# EAGLE design Maka Niu Endcap (EAGLE 9.6.2)
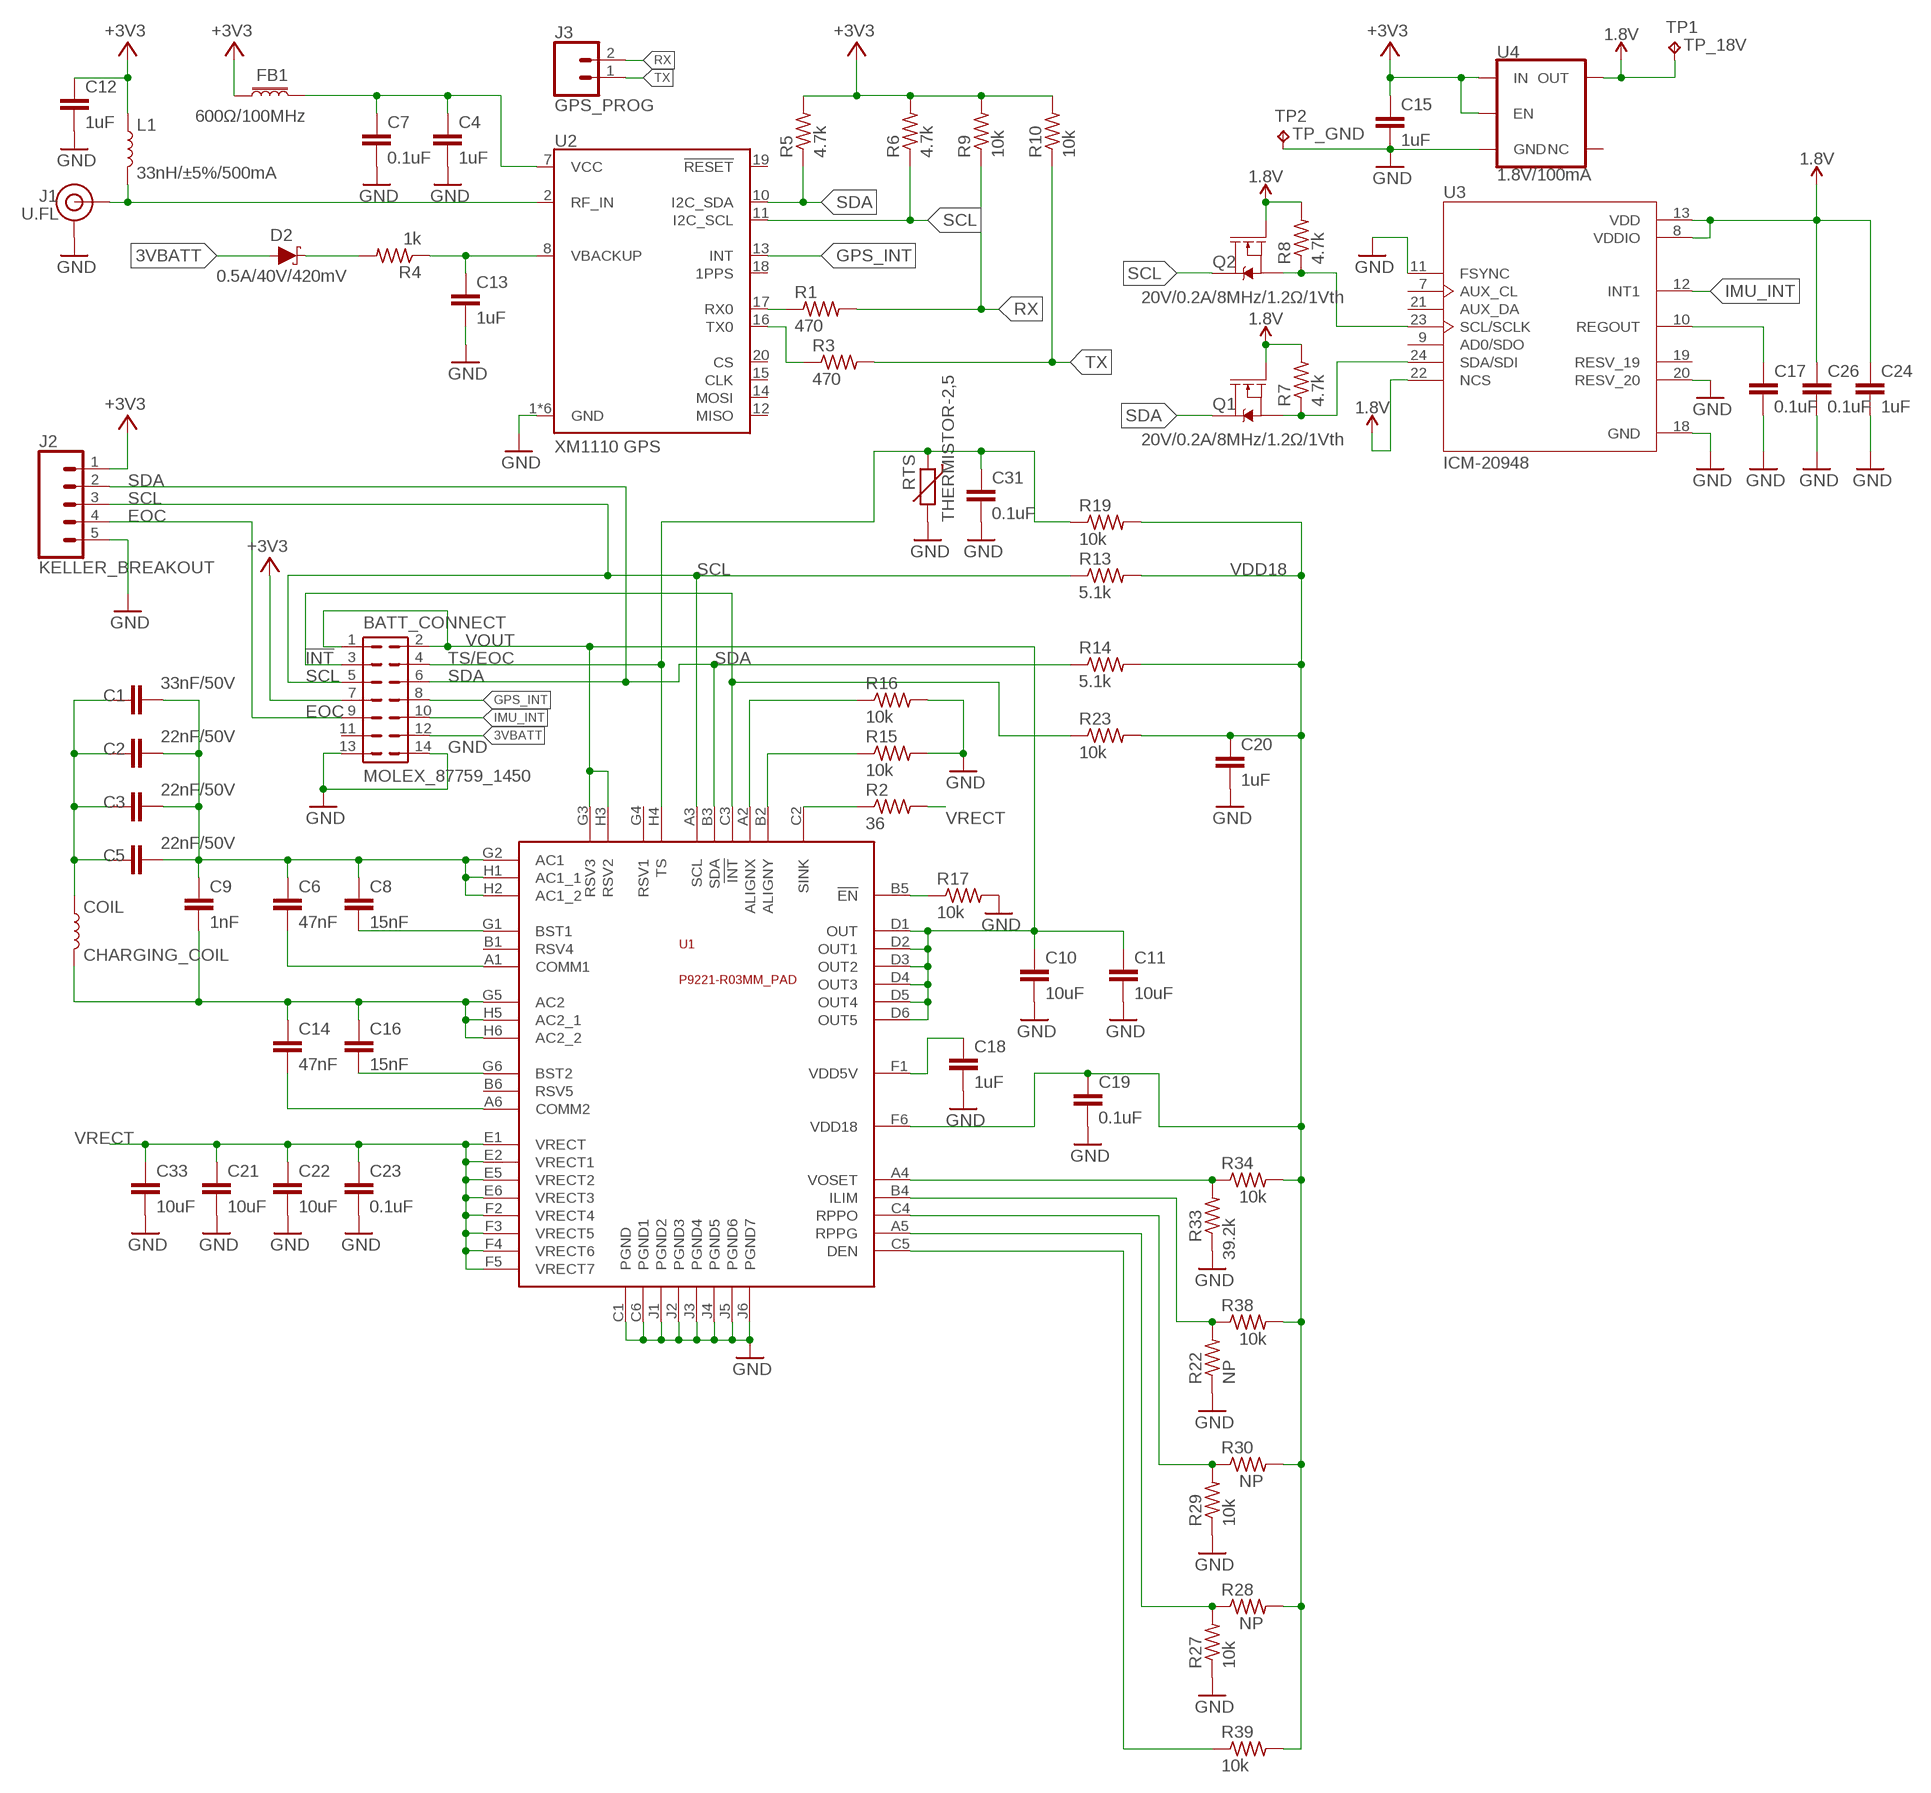
[diagram p0: schematic, sheet 1]

## Parts
BATT_CONNECT  MOLEX_87759_1450  [87759-1450]
C1  33nF/50V  C-EUC0402  [C0402]
C2  22nF/50V  C-EUC0402  [C0402]
C3  22nF/50V  C-EUC0402  [C0402]
C4  1uF  C-EUC0402  [C0402]
C5  22nF/50V  C-EUC0402  [C0402]
C6  47nF  C-EUC0402  [C0402]
C7  0.1uF  C-EUC0402  [C0402]
C8  15nF  C-EUC0402  [C0402]
C9  1nF  C-EUC0402  [C0402]
C10  10uF  C0603C0603W  [C_0603]
C11  10uF  C0603C0603W  [C_0603]
C12  1uF  C-EUC0402  [C0402]
C13  1uF  C-EUC0402  [C0402]
C14  47nF  C-EUC0402  [C0402]
C15  1uF  C-EUC0402  [C0402]
C16  15nF  C-EUC0402  [C0402]
C17  0.1uF  C-EUC0402  [C0402]
C18  1uF  C-EUC0402  [C0402]
C19  0.1uF  C-EUC0201  [C0201]
C20  1uF  C-EUC0402  [C0402]
C21  10uF  C0603C0603W  [C_0603]
C22  10uF  C0603C0603W  [C_0603]
C23  0.1uF  C-EUC0201  [C0201]
C24  1uF  C-EUC0402  [C0402]
C26  0.1uF  C-EUC0402  [C0402]
C31  0.1uF  C-EUC0201  [C0201]
C33  10uF  C0603C0603W  [C_0603]
COIL  CHARGING_COIL  [CHARGING_COIL]
D2  0.5A/40V/420mV  DIODE-SCHOTTKY-PMEG4005EJ  [SOD-323]
FB1  600Ω/100MHz  FERRITE_BEAD-0603  [0603]
J1  U.FL  U.FL2PIN  [U.FL]
J2  KELLER_BREAKOUT  WIRES_2MM_05  [WIRES_2MM_05]
J3  GPS_PROG  WIRES_2MM_02SMD  [WIRES_2MM_02SMD]
L1  33nH/±5%/500mA  INDUCTOR-0603-33NH  [0603]
Q1  20V/0.2A/8MHz/1.2Ω/1Vth  MOSFET-NCH-RE1C00UNTL  [SOT-416FL]
Q2  20V/0.2A/8MHz/1.2Ω/1Vth  MOSFET-NCH-RE1C00UNTL  [SOT-416FL]
R1  470  R-US_R0402  [R0402]
R2  36  R-US_R0805  [R0805]
R3  470  R-US_R0402  [R0402]
R4  1k  R-US_R0402  [R0402]
R5  4.7k  R-US_R0402  [R0402]
R6  4.7k  R-US_R0402  [R0402]
R7  4.7k  R-US_R0402  [R0402]
R8  4.7k  R-US_R0402  [R0402]
R9  10k  R-US_R0402  [R0402]
R10  10k  R-US_R0402  [R0402]
R13  5.1k  R-US_R0402  [R0402]
R14  5.1k  R-US_R0402  [R0402]
R15  10k  R0603R0603W  [R_0603]
R16  10k  R0603R0603W  [R_0603]
R17  10k  R-US_R0402  [R0402]
R19  10k  R-US_R0402  [R0402]
R22  NP  R-US_R0402  [R0402]
R23  10k  R-US_R0402  [R0402]
R27  10k  R-US_R0402  [R0402]
R28  NP  R-US_R0402  [R0402]
R29  10k  R-US_R0402  [R0402]
R30  NP  R-US_R0402  [R0402]
R33  39.2k  R-US_R0402  [R0402]
R34  10k  R-US_R0402  [R0402]
R38  10k  R-US_R0402  [R0402]
R39  10k  R-US_R0402  [R0402]
RTS  THERMISTOR-2,5  [RS-2,5]
TP1  TP_18V  TPB1,27  [B1,27]
TP2  TP_GND  TPB1,27  [B1,27]
U1  P9221-R03MM_PAD  [CSP52_2P64X3P94_0P4MM_03MMPAD]
U2  XM1110 GPS  XM1110_GPS  [XM1110_GPS]
U3  ICM-20948  [QFN40P300X300X105-24N]
U4  1.8V/100mA  V_REG_SP6214-1.8V  [SC70]

## Nets
1.8V: C24.1 C26.1 Q1.1(G) Q2.1(G) R7.2 R8.2 TP1.TP U3.8(VDDIO) U3.13(VDD) U3.22(NCS) U4.5(OUT)
3VBATT: BATT_CONNECT.12 D2.A
!INT: BATT_CONNECT.3 R23.1 U1.C3(!INT)
+3V3: BATT_CONNECT.7 C12.1 C15.1 FB1.1 J2.1 L1.1 R5.2 R6.2 R9.2 R10.2 U4.1(IN) U4.3(EN)
AC1: C1.2 C2.2 C3.2 C5.2 C6.1 C8.1 C9.1 U1.G2(AC1) U1.H1(AC1_1) U1.H2(AC1_2)
AC2: C9.2 C14.1 C16.1 COIL.B2 U1.G5(AC2) U1.H5(AC2_1) U1.H6(AC2_2)
ALIGNX: R16.1 U1.A2(ALIGNX)
ALIGNY: R15.1 U1.B2(ALIGNY)
BST1: C8.2 U1.G1(BST1)
BST2: C16.2 U1.G6(BST2)
COMM1: C6.2 U1.A1(COMM1)
COMM2: C14.2 U1.A6(COMM2)
DEN: R39.1 U1.C5(DEN)
EOC: BATT_CONNECT.9 J2.4
GND: BATT_CONNECT.13 BATT_CONNECT.14 C4.2 C7.2 C10.2 C11.2 C12.2 C13.2 C15.2 C17.2 C18.2 C19.2 C20.2 C21.2 C22.2 C23.2 C24.2 C26.2 C31.2 C33.2 J1.1(GND) J1.2(GND) J2.5 R15.2 R16.2 R17.2 R22.1 R27.1 R29.1 R33.1 RTS.2 TP2.TP U1.C1(PGND) U1.C6(PGND1) U1.J1(PGND2) U1.J2(PGND3) U1.J3(PGND4) U1.J4(PGND5) U1.J5(PGND6) U1.J6(PGND7) U2.1(GND) U2.3(GND) U2.4(GND) U2.5(GND) U2.6(GND) U2.9(GND) U3.11(FSYNC) U3.18(GND) U3.20(RESV_20) U4.2(GND)
GPS_INT: BATT_CONNECT.8 U2.13(INT)
ILIM: R22.2 R38.1 U1.B4(ILIM)
IMU_INT: BATT_CONNECT.10 U3.12(INT1)
LC: C1.1 C2.1 C3.1 C5.1 COIL.B1
N$6: R17.1 U1.B5(!EN)
N$24: D2.C R4.2
REGOUT: C17.1 U3.10(REGOUT)
RF_IN: J1.FEED(SIGNAL) L1.2 U2.2(RF_IN)
RPPG: R27.2 R28.1 U1.A5(RPPG)
RPPO: R29.2 R30.1 U1.C4(RPPO)
RX: J3.2 R1.2 R9.1
RX0: R1.1 U2.17(RX0)
SCL: BATT_CONNECT.5 J2.3 Q2.3(D) R6.1 R13.1 U1.A3(SCL) U2.11(I2C_SCL)
SCL/SCLK: Q2.2(S) R8.1 U3.23(SCL/SCLK)
SDA: BATT_CONNECT.6 J2.2 Q1.3(D) R5.1 R14.1 U1.B3(SDA) U2.10(I2C_SDA)
SDA/SDI: Q1.2(S) R7.1 U3.24(SDA/SDI)
SINK: R2.1 U1.C2(SINK)
TS/EOC: BATT_CONNECT.4 C31.1 R19.1 RTS.1 U1.H4(TS)
TX: J3.1 R3.2 R10.1
TX0: R3.1 U2.16(TX0)
VBACKUP: C13.1 R4.1 U2.8(VBACKUP)
VCC: C4.1 C7.1 FB1.2 U2.7(VCC)
VDD5V: C18.1 U1.F1(VDD5V)
VDD18: C19.1 C20.1 R13.2 R14.2 R19.2 R23.2 R28.2 R30.2 R34.2 R38.2 R39.2 U1.F6(VDD18)
VOSET: R33.2 R34.1 U1.A4(VOSET)
VOUT: BATT_CONNECT.1 BATT_CONNECT.2 C10.1 C11.1 U1.D1(OUT) U1.D2(OUT1) U1.D3(OUT2) U1.D4(OUT3) U1.D5(OUT4) U1.D6(OUT5) U1.G3(RSV3) U1.H3(RSV2)
VRECT: C21.1 C22.1 C23.1 C33.1 R2.2 U1.E1(VRECT) U1.E2(VRECT1) U1.E5(VRECT2) U1.E6(VRECT3) U1.F2(VRECT4) U1.F3(VRECT5) U1.F4(VRECT6) U1.F5(VRECT7)
Unconnected: BATT_CONNECT.11 U1.B1(RSV4) U1.B6(RSV5) U1.G4(RSV1) U2.12(MISO) U2.14(MOSI) U2.15(CLK) U2.18(1PPS) U2.19(!RESET) U2.20(CS) U3.7(AUX_CL) U3.9(AD0/SDO) U3.19(RESV_19) U3.21(AUX_DA) U4.4(NC)

## Library data of the parts
BATT_CONNECT = maka-niu:MOLEX_87759_1450; DIGI-KEY_PART_NUMBER: WM18654-ND; MF: MOLEX; MP: 0877591450
C1 = rcl:C-EU: CAPACITOR, European symbol; DIGI-KEY_PART_NUMBER: 490-13296-1-ND; MF: Murata Electronics; MP: GRM155R71H333KE02D; SPICEPREFIX: C
C2 C3 C5 = rcl:C-EU: CAPACITOR, European symbol; DIGI-KEY_PART_NUMBER: 490-6360-1-ND; MF: Murata Electronics; MP: GRM155R71H223KA12J; SPICEPREFIX: C
C4 C12 C13 C15 C18 C20 C24 = rcl:C-EU: CAPACITOR, European symbol; DIGI-KEY_PART_NUMBER: 311-1439-1-ND; MF: Yageo; MP: CC0402KRX5R6BB105; SPICEPREFIX: C
C6 C14 = rcl:C-EU: CAPACITOR, European symbol; DIGI-KEY_PART_NUMBER: 490-10702-1-ND; MF: Murata Electronics; MP: GRM155R71H473KE14D; SPICEPREFIX: C
C7 C17 C26 = rcl:C-EU: CAPACITOR, European symbol; DIGI-KEY_PART_NUMBER: 490-11917-1-ND; MF: Murata Electronics; MP: GRM155R61H104KE19D; SPICEPREFIX: C
C8 C16 = rcl:C-EU: CAPACITOR, European symbol; DIGI-KEY_PART_NUMBER: 490-16428-1-ND; MF: Murata Electronics; MP: GCM155R71H153JA55D; SPICEPREFIX: C
C9 = rcl:C-EU: CAPACITOR, European symbol; DIGI-KEY_PART_NUMBER: 732-7556-1-ND; MF: Würth Elektronik; MP: 885012205061; SPICEPREFIX: C
C10 C11 C21 C22 C33 = maka-niu:C0603; DIGI-KEY_PART_NUMBER: 445-9015-1-ND; MF: TDK Corporation; MP: C1608X5R1E106M080AC
C19 C31 = rcl:C-EU: CAPACITOR, European symbol; DIGI-KEY_PART_NUMBER: 445-7318-1-ND; MF: TDK Corporation; MP: C0603X5R1A104K030BC; SPICEPREFIX: C
C23 = rcl:C-EU: CAPACITOR, European symbol; DIGI-KEY_PART_NUMBER: 1276-1318-1-ND; MF: Samsung Electro-Mechanics; MP: CL03A104KA3NNNC; SPICEPREFIX: C
COIL = maka-niu:CHARGING_COIL
D2 = SparkFun-DiscreteSemi:DIODE-SCHOTTKY: Schottky diode A Schottky diode is a semiconductor diode which has a low forward voltage drop and a very fast switching action.; DIGI-KEY_PART_NUMBER: 1727-5209-1-ND; MF: Nexperia USA Inc.; MP: PMEG4005AEA,115; PROD_ID: DIO-10955
FB1 = SparkFun-Coils:FERRITE_BEAD: Ferrite Bead (blocks, cores, rings, chokes, etc.) Inductor with layers of ferrite used to suppress high frequencies. Often used to isolate high frequency noise. SparkFun Products: IOIO-OTG - V2.2 <https://www.sparkfun.com/products/13613> SparkFun SAMD21 Mini Breakout <https://www.sparkfun.com/products/13664> SparkFun 6 Degrees of Freedom Breakout - LSM6DS3 <https://www.sparkfun.com/products/13339> SparkFun SAMD21 Dev Breakout <https://www.sparkfun.com/products/13672>; DIGI-KEY_PART_NUMBER: 445-172898-1-ND; MF: TDK Corporation; MP: MPZ1608S601ATD25; PROD_ID: NDUC-07859; VALUE: 30Ω/1.8A
J1 = SparkFun-Connectors:U.FL2PIN: SMD Antenna Connector - U.FL 2mm height, 3.0mm x 3.0mm receptacle size. SparkFun Products: SparkFun WiFi Shield - ESP8266 <https://www.sparkfun.com/products/13287> SparkFun ESP8266 Thing <https://www.sparkfun.com/products/13231> SparkFun MiniGen - Pro Mini Signal Generator Shield <https://www.sparkfun.com/products/11420>; DIGI-KEY_PART_NUMBER: A144746CT-ND; MF: TE Connectivity AMP Connectors; MP: 2337019-1; PROD_ID: CONN-09193; SF_ID: WRL-09144
J2 = maka-niu:WIRES_2MM_05: 5 pin through hole 2mm pitch
J3 = maka-niu:WIRES_2MM_02SMD: 2 pin surface mount 2mm pitch
L1 = SparkFun-Coils:INDUCTOR: Inductors Resist changes in electrical current. Basically a coil of wire. SparkFun Products: SparkFun Load Cell Amplifier - HX711 <https://www.sparkfun.com/products/13879> IOIO-OTG - V2.2 <https://www.sparkfun.com/products/13613>; DIGI-KEY_PART_NUMBER: 490-14837-1-ND; MF: Murata Electronics; MP: LQG18HH33NJ00D; PROD_ID: NDUC-07874
Q1 Q2 = SparkFun-DiscreteSemi:MOSFET-NCH: N-channel MOSFETs Voltage controlled devices that allow control of high current outputs. SparkFun Products: SparkFun OpenScale <https://www.sparkfun.com/products/13261> SparkFun Digital Sandbox <https://www.sparkfun.com/products/12651> SparkFun Monster Moto Shield <https://www.sparkfun.com/products/10182> SparkFun MOSFET Power Controller <https://www.sparkfun.com/products/11214>; DIGI-KEY_PART_NUMBER: RE1C002UNTCLCT-ND; MF: Rohm Semiconductor; MP: RE1C002UNTCL; PROD_ID: TRANS-14399
R1 R3 = rcl:R-US_: RESISTOR, American symbol; DIGI-KEY_PART_NUMBER: RMCF0402JT470RCT-ND; MF: Stackpole Electronics Inc.; MP: RMCF0402JT470R; SPICEPREFIX: R
R2 = rcl:R-US_: RESISTOR, American symbol; DIGI-KEY_PART_NUMBER: P36ADCT-ND; MF: Panasonic Electronic Components; MP: ERJ-P06J360V; SPICEPREFIX: R
R4 = rcl:R-US_: RESISTOR, American symbol; DIGI-KEY_PART_NUMBER: RMCF0402JT1K00CT-ND; MF: Stackpole Electronics Inc.; MP: RMCF0402JT1K00; SPICEPREFIX: R
R5-R8 = rcl:R-US_: RESISTOR, American symbol; DIGI-KEY_PART_NUMBER: RMCF0402JT4K70CT-ND; MF: Stackpole Electronics Inc.; MP: RMCF0402JT4K70; SPICEPREFIX: R
R9 R10 = rcl:R-US_: RESISTOR, American symbol; DIGI-KEY_PART_NUMBER: RMCF0402JT10K0CT-ND; MF: Stackpole Electronics Inc.; MP: RMCF0402JT10K0; SPICEPREFIX: R
R13 R14 = rcl:R-US_: RESISTOR, American symbol; DIGI-KEY_PART_NUMBER: CR0402-JW-512GLFCT-ND; MF: Bourns Inc.; MP: CR0402-JW-512GLF; SPICEPREFIX: R
R15 R16 = maka-niu:R0603; DIGI-KEY_PART_NUMBER: 311-10.0KHRCT-ND; MF: Yageo; MP: RC0603FR-0710KL
R17 R19 R23 R27 R29 R34 R38 R39 = rcl:R-US_: RESISTOR, American symbol; DIGI-KEY_PART_NUMBER: 541-10KATCT-ND; MF: Vishay Dale; MP: CRCW040210K0JNEDIF; SPICEPREFIX: R
R22 R28 R30 = rcl:R-US_: RESISTOR, American symbol; SPICEPREFIX: R
R33 = rcl:R-US_: RESISTOR, American symbol; DIGI-KEY_PART_NUMBER: 311-39.2KLBCT-ND; MF: Yageo; MP: AC0402FR-0739K2L; SPICEPREFIX: R
RTS = maka-niu:THERMISTOR: THERMISTOR
TP1 = testpad:TP: Test pad; TP_SIGNAL_NAME: TP_18V
TP2 = testpad:TP: Test pad; TP_SIGNAL_NAME: TP_GND
U1 = maka-niu:P9221-R: Renesas/IDT P9221-R 15W Qi Wireless Charging Receiver; DIGI-KEY_PART_NUMBER: 800-3932-2-ND; MF: Renesas Electronics America Inc.; MP: P9221-RAHGI8
U2 = maka-niu:XM1110_GPS: AirPrime XM1110 GPS; DIGI-KEY_PART_NUMBER: 1645-XM1110_1104311CT-ND; MF: Sierra Wireless; MP: XM1110_1104311
U3 = ICM-20948:ICM-20948: Axis=3 Axis Gyro+3 Axis Accel+Compass. Pin For Pin With m; DESCRIPTION: Accelerometer, Gyroscope, Magnetometer, 9 Axis Sensor I²C, SPI Output; DIGI-KEY_PART_NUMBER: 1428-1123-1-ND; MF: TDK InvenSense; MP: ICM-20948; PACKAGE: QFN-24 InvenSense
U4 = SparkFun-IC-Power:V_REG_SP6214: Voltage Regulator - SP6214 SP6214 Series SC-70-5 Micropower SC-70 100 mA CMOS LDO Regulator Datasheet <https://www.exar.com/content/document.ashx?id=654> SparkFun Products: MP3 Trigger <https://www.sparkfun.com/products/13720> SparkFun Particle Sensor Breakout <https://www.sparkfun.com/products/14045>; DIGI-KEY_PART_NUMBER: 576-2807-1-ND; MF: Microchip Technology; MP: MIC5253-1.8YC5-TR; PROD_ID: VREG-08428

## Board
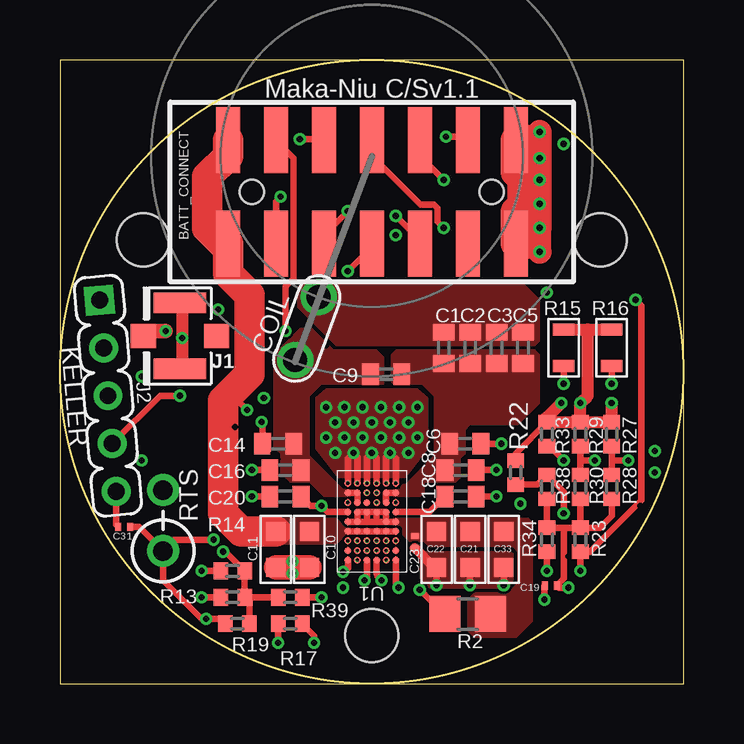
[diagram p1: board, top side]
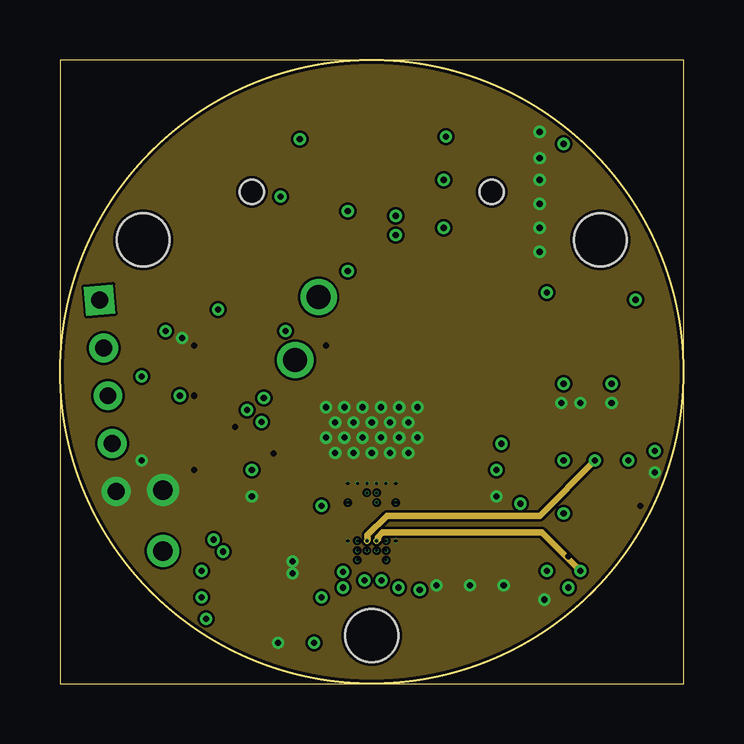
[diagram p2: board, inner layer Route2]
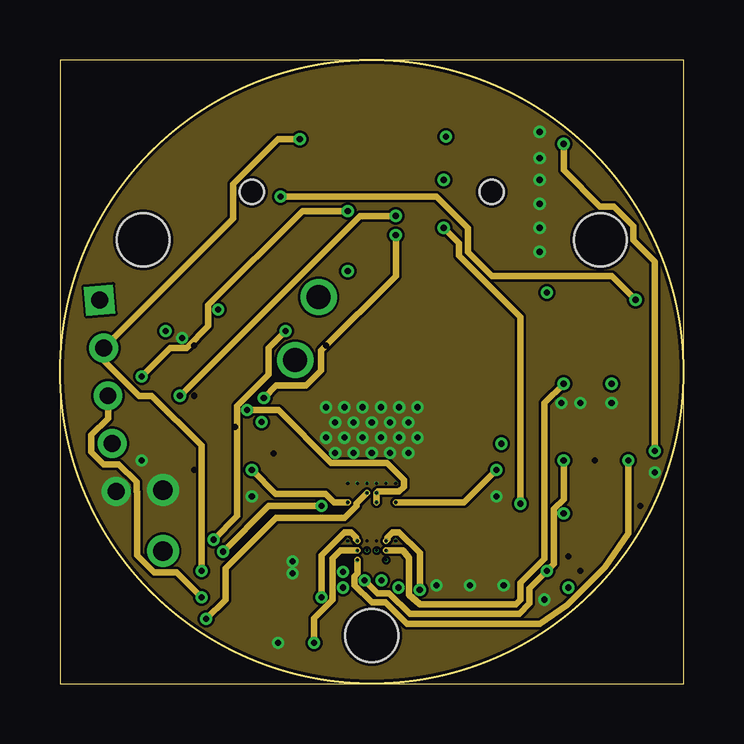
[diagram p3: board, inner layer Route3]
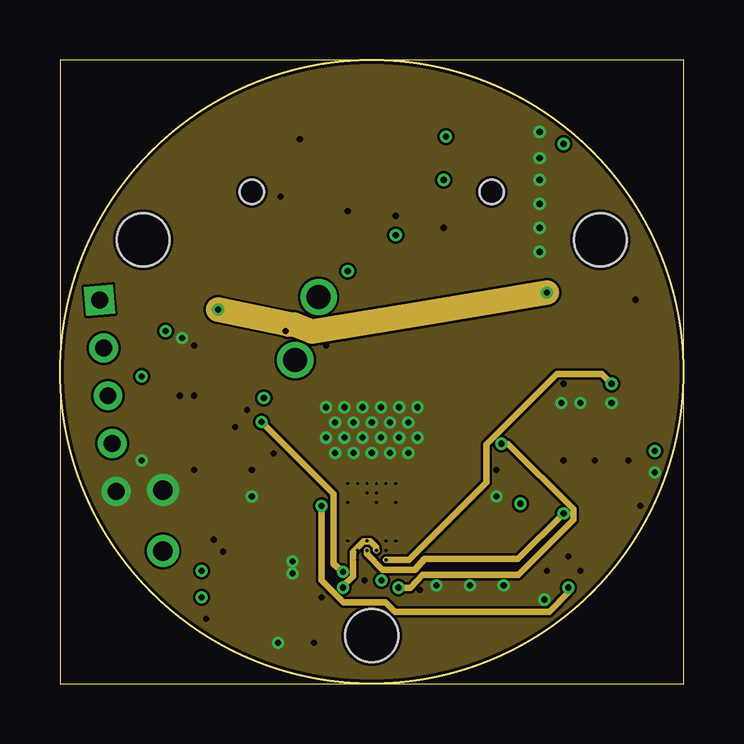
[diagram p4: board, inner layer Route14]
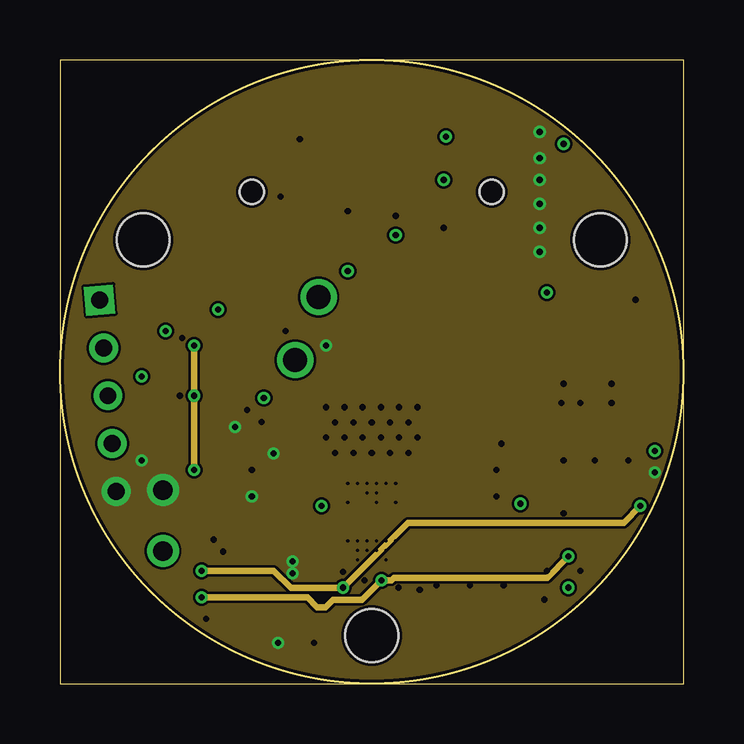
[diagram p5: board, inner layer Route15]
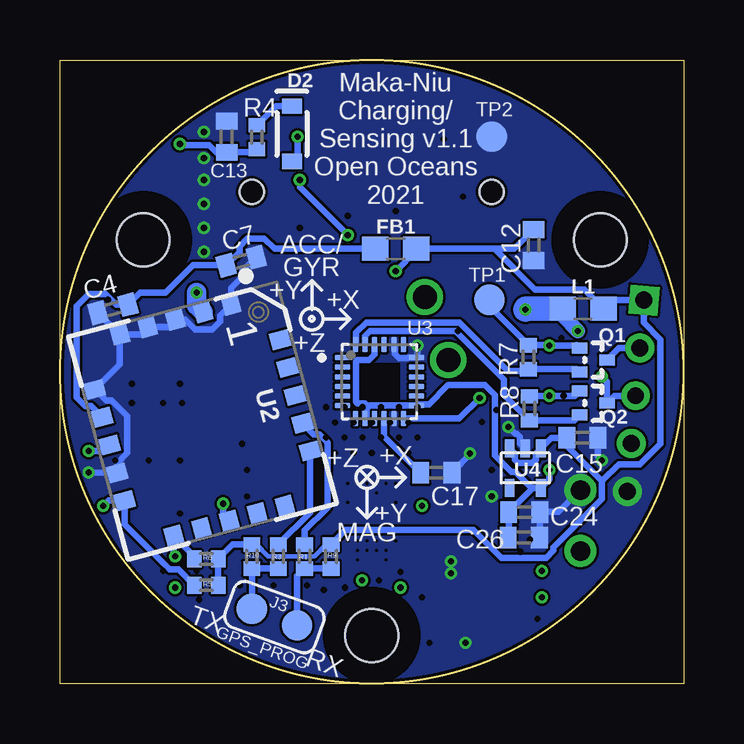
[diagram p6: board, bottom side, seen from below]

Size 26 x 26 mm. Coordinates in mm from the lower left corner, seen from the top.
Outline: 0,0 26,0 26,26 0,26 0,0
Outline: circle at 13,13 radius 13
Copper layers ([3:[2:[14:1+2+3*14+(15*16)]]]): Top 0.035mm / dielectric 0.075mm / Route2 0.035mm / dielectric 0.075mm / Route3 0.035mm / dielectric 0.075mm / Route14 0.035mm / dielectric 0.18mm / Route15 0.035mm / dielectric 0.9mm / Bottom 0.035mm
Design rules "default *": minimum track width 6mil, minimum drill 5mil, track to track 4mil, track to pad 4mil, pad to pad 4mil, via to via 4mil, smd to smd 4mil, copper to edge 6mil, drill to drill 6mil, minimum pad ring 10mil, minimum via ring 0mil, stop-mask expansion 4mil, vias tented up to drill 0mil, thermal gap 10mil
Holes 2.2 mm at 13,2 22.53,18.5 3.47,18.5
tRestrict: area 11,0 to 15,4; area 20.5,16.5 to 24.5,20.5; area 1.5,16.5 to 5.5,20.5
bRestrict: area 11,0 to 15,4; area 1.5,16.5 to 5.5,20.5; area 20.5,16.5 to 24.5,20.5

### Footprints (pad centres in the part's own frame; a part is rotated, then mirrored left to right if it is on the bottom)
87759-1450 = smd 1 x 2.75: 1 -6,-2.15; 2 -6,2.15; 3 -4,-2.15; 4 -4,2.15; 5 -2,-2.15; 6 -2,2.15; 7 0,-2.15; 8 0,2.15; 9 2,-2.15; 10 2,2.15; 11 4,-2.15; 12 4,2.15; 13 6,-2.15; 14 6,2.15 | hole 1: -5,0; 5,0
C0402 = smd 0.7 x 0.9: 1 -0.65,0; 2 0.65,0
C_0603 = smd 0.8 x 0.8: 1 -0.75,0; 2 0.75,0
C0201 = smd 0.25 x 0.35: 1 -0.25,0; 2 0.25,0
CHARGING_COIL = drill 1: B1 -1.4,0; B2 1.4,0
SOD-323 = smd 0.63 x 0.83: A 1.15,0; C -1.15,0
0603 = smd 1.1 x 1: 1 -0.85,0; 2 0.85,0
U.FL = smd 2.2 x 0.85: 1 0,1.375; 2 0,-1.375 | smd 1.05 x 1: FEED 1.525,0; NC -1.525,0
WIRES_2MM_05 = drill 0.7 square: 1 -4,0 | drill 0.7: 2 -2,0; 3 0,0; 4 2,0; 5 4,0
WIRES_2MM_02SMD = smd 1.27 x 1.27: 1 -1,0; 2 1,0
SOT-416FL = smd 0.46 x 0.65: 1 -0.5,-1.1; 2 0.5,-1.1; 3 0,0.05
R0402 = smd 0.6 x 0.7: 1 -0.5,0; 2 0.5,0
R0805 = smd 1.3 x 1.5: 1 -0.95,0; 2 0.95,0
R_0603 = smd 0.5 x 0.9: 1 -0.762,0; 2 0.762,0
RS-2,5 = drill 0.813: 1 -1.27,0; 2 1.27,0
B1,27 = smd 1.27 x 1.27: TP 0,0
CSP52_2P64X3P94_0P4MM_03MMPAD = smd 0.3 x 0.3: A1 -1,1.6; A2 -0.6,1.6; A3 -0.2,1.6; A4 0.2,1.6; A5 0.6,1.6; A6 1,1.6; B1 -1,1.2; B2 -0.6,1.2; B3 -0.2,1.2; B4 0.2,1.2; B5 0.6,1.2; B6 1,1.2; C1 -1,0.8; C2 -0.6,0.8; C3 -0.2,0.8; C4 0.2,0.8; C5 0.6,0.8; C6 1,0.8; D1 -1,0.4; D2 -0.6,0.4; D3 -0.2,0.4; D4 0.2,0.4; D5 0.6,0.4; D6 1,0.4; E1 -1,0; E2 -0.6,0; E5 0.6,0; E6 1,0; F1 -1,-0.4; F2 -0.6,-0.4; F3 -0.2,-0.4; F4 0.2,-0.4; F5 0.6,-0.4; F6 1,-0.4; G1 -1,-0.8; G2 -0.6,-0.8; G3 -0.2,-0.8; G4 0.2,-0.8; G5 0.6,-0.8; G6 1,-0.8; H1 -1,-1.2; H2 -0.6,-1.2; H3 -0.2,-1.2; H4 0.2,-1.2; H5 0.6,-1.2; H6 1,-1.2; J1 -1,-1.6; J2 -0.6,-1.6; J3 -0.2,-1.6; J4 0.2,-1.6; J5 0.6,-1.6; J6 1,-1.6
XM1110_GPS = smd 0.8 x 0.7: 1 -4.35,2.4; 2 -4.35,1.2; 3 -4.35,0; 4 -4.35,-1.2; 5 -4.35,-2.4; 11 4.35,-2.4; 12 4.35,-1.2; 13 4.35,0; 14 4.35,1.2; 15 4.35,2.4 | smd 0.7 x 0.8: 6 -2.4,-4; 7 -1.2,-4; 8 0,-4; 9 1.2,-4; 10 2.4,-4; 16 2.4,4; 17 1.2,4; 18 0,4; 19 -1.2,4; 20 -2.4,4
QFN40P300X300X105-24N = smd 0.64 x 0.22: 1 -1.545,1; 2 -1.545,0.6; 3 -1.545,0.2; 4 -1.545,-0.2; 5 -1.545,-0.6; 6 -1.545,-1; 13 1.545,-1; 14 1.545,-0.6; 15 1.545,-0.2; 16 1.545,0.2; 17 1.545,0.6; 18 1.545,1 | smd 0.22 x 0.64: 7 -1,-1.545; 8 -0.6,-1.545; 9 -0.2,-1.545; 10 0.2,-1.545; 11 0.6,-1.545; 12 1,-1.545; 19 1,1.545; 20 0.6,1.545; 21 0.2,1.545; 22 -0.2,1.545; 23 -0.6,1.545; 24 -1,1.545
SC70 = smd 0.4 x 0.75: 1 -0.65,-0.825; 2 0,-0.825; 3 0.65,-0.825; 4 0.65,0.825; 5 -0.65,0.825

### Placement (x,y rotation side)
BATT_CONNECT  13,20.5 0 top
C1  16,14 270 top
C2  17.1,14 270 top
C3  18.2,14 270 top
C4  23.79,15.63 195 bottom
C5  19.3,14 270 top
C6  16.9,10 0 top
C7  18.44,17.61 15 bottom
C8  16.7,8.9 0 top
C9  13.6,12.9 180 top
C10  10.4,5.6 270 top
C11  9,5.6 270 top
C12  6.25,18.28 270 bottom
C13  19.05,22.8 90 bottom
C14  9.1,10 180 top
C15  4.22,10.25 0 bottom
C16  9.4,8.9 180 top
C17  10.31,8.79 0 bottom
C18  16.7,7.8 0 top
C19  20.46,4.09 180 top
C20  9.4,7.8 180 top
C21  17.1,5.6 270 top
C22  15.7,5.6 270 top
C23  14.8,5.9 270 top
C24  6.64,7.15 0 bottom
C26  6.66,6.09 0 bottom
C31  2.68,6.53 180 top
C33  18.5,5.6 270 top
COIL  10.3,14.8 249.6 top
D2  16.33,22.92 270 bottom
FB1  12,18.13 180 bottom
J1  5,14.5 180 top
J2  2,12 275 top
J3  17.06,2.77 340 bottom
L1  4.19,15.63 180 bottom
Q1  3.24,13.49 270 bottom
Q2  3.24,11.69 270 bottom
R1  15.8,5.3 270 bottom
R2  17,2.9 0 top
R3  16.9,5.3 270 bottom
R4  17.79,22.78 90 bottom
R5  19.9,4.1 0 bottom
R6  19.9,5.2 0 bottom
R7  6.47,13.61 90 bottom
R8  6.43,11.47 90 bottom
R9  14.7,5.3 90 bottom
R10  18,5.3 90 bottom
R13  7.2,3.6 0 top
R14  7.2,4.7 0 top
R15  21,14 90 top
R16  23,14 90 top
R17  9.6,2.5 180 top
R19  7.4,2.5 0 top
R22  19,8.8 270 top
R23  21.7,6 90 top
R27  23,10.4 270 top
R28  23,8.2 270 top
R29  21.7,10.4 270 top
R30  21.7,8.2 270 top
R33  20.3,10.4 270 top
R34  20.3,6 90 top
R38  20.3,8.2 270 top
R39  9.6,3.6 180 top
RTS  4.3,6.8 90 top
TP1  8.1,16 0 bottom
TP2  8,22.8 0 bottom
U1  13,6.75 180 top
U2  20.06,10.98 285 bottom
U3  12.68,12.59 0 bottom
U4  6.6,8.98 180 bottom

### Tracks (layer width: path | path; a pad name or v marks a point on that pad's centre or on a via)
1.8V  (via drill 0.25 pad 0.51 layers 15-16)
  Route15 0.268: v5.6,14.1 v5.6,12 v5.6,8.9
  Bottom 0.268: Q1.1 4.46,14.11 4.47,14.1 v5.6,14.1 v5.61,14.11 R7.2 8.1,15.74 TP1.TP | C26.1 7.29,6.11 C24.1 6.29,8.15 U4.5 | U4.5 6.34,8.15 7.01,8.82 7.18,8.82 7.86,9.51 7.86,12.02 8.28,12.44 9.79,12.44 9.85,12.42 10.62,11.64 11.08,11.64 U3.13 11.48,11.59 11.49,11.6 13.07,11.6 13.23,11.45 13.23,11.1 U3.8 13.28,11.69 13.59,11.69 13.66,11.76 13.66,13.42 13.59,13.49 13.11,13.49 12.88,13.72 U3.22 | U4.5 5.6,8.51 v5.6,8.9 | R8.2 6.4,12 v5.6,12 4.53,12 Q2.1
3VBATT  (via drill 0.25 pad 0.51)
  Top 0.268: v16.1,22.8 16.85,22.8 BATT_CONNECT.12
  Bottom 0.268: D2.A 16.1,22 v16.1,22.8
!INT  (via drill 0.13 pad 0.15 layers 1-2, 0.25 pad 0.51 layers 1-2, 0.25 pad 0.51 layers 1-3)
  Top 0.268: v21.7,4.7 R23.1 22.1,5.5 24.24,7.64 24.24,15.76 v24,16 | BATT_CONNECT.3 9,20.1 v9.2,20.3
  Route2 0.268: U1.C3 13.25,6 13.25,6.09 13.46,6.3 20.1,6.3 v21.7,4.7
  Route3 0.268: v24,16 23,17 18,17 17,18 17,19 15.7,20.3 v9.2,20.3
  other vias: 13.2,5.95
+3V3  (via drill 0.25 pad 0.51)
  Top 0.268: v12,17.2 13,18.2 BATT_CONNECT.7
  Bottom 0.152: R10.2 17.8,5.8 | 14.9,5.8 R9.2
  Bottom 0.18: 17.8,5.8 17.32,5.3 | 15.38,5.3 14.9,5.8
  Bottom 0.19: 17.32,5.3 15.38,5.3
  Bottom 0.268: R5.2 R6.2 18.8,5.8 R10.2 | 6.23,18.95 C12.1 7.05,18.13 7.88,18.13 | 7.88,18.13 FB1.1 11.15,18.05 v12,17.2 | 7.88,18.13 6.19,16.43 4.14,16.43 L1.1 2.98,15.98 J2.1 1.65,15.04 0.96,14.35 0.96,10 1.81,9.14 2.7,9.14 3.4,8.44 | U4.3 7.04,9.59 7.04,9.33 6.9,9.19 6.3,9.19 6.16,9.33 6.16,9.59 U4.1 5.5,10.25 C15.1 4.87,9.91 3.4,8.44 | R9.2 14.1,6.4 8.75,6.4 7.59,5.24 5.73,5.24 5.42,5.54 5.42,5.68 3.4,7.7 3.4,8.44
AC1
  Top 0.268: U1.G2 U1.H2 U1.H1
  pour Top (no thermals): 13.9,12.5 15.1,12.5 15.6,12 15.6,9.5 14.4,8.3 14.3,8.3 14.2,8.2 14.2,8.1 13.9,8.1 13.9,7.8 15,7.8 15.2,8 15.2,8.4 16.5,8.4 16.7,8.6 16.7,9.4 16.9,9.6 16.9,10.6 17.1,10.8 19.1,10.8 20,11.7 20,13.7 19.8,13.9 14,13.9 13.8,13.7 13.8,12.6
AC2
  Top 0.268: U1.H6 U1.H5 U1.G5
  pour Top (no thermals): 10.9,12.5 13.5,12.5 13.5,13.6 13.2,13.9 11.4,13.9 10.5,14.8 10,14.8 8.9,13.7 8.9,9.9 9.2,9.6 9.2,8.8 9.6,8.4 10.4,8.4 11,7.8 12.1,7.8 12.1,8.1 11.8,8.1 10.4,9.5 10.4,12
ALIGNX  (via drill 0.13 pad 0.15 layers 1-14, 0.25 pad 0.51 layers 1-14)
  Top 0.268: v23,12.5 R16.1
  Route14 0.268: U1.A2 14.55,5.15 17.79,8.39 17.79,9.97 20.73,12.91 20.83,12.91 21,12.91 22.59,12.91 v23,12.5
  other vias: 13.6,5.15
ALIGNY  (via drill 0.13 pad 0.15 layers 1-3, 0.25 pad 0.51 layers 1-3)
  Top 0.268: v21,12.5 R15.1
  Route3 0.268: U1.B2 14.3,5.55 14.55,5.25 14.55,3.7 15,3.3 19,3.3 19.2,3.5 19.2,4.2 20.2,5.2 20.2,11.7 v21,12.5
  other vias: 13.6,5.55
BST1  (via drill 0.13 pad 0.15 layers 1-3, 0.25 pad 0.51 layers 1-3)
  Top 0.268: v18.2,8.9 C8.2
  Route3 0.268: U1.G1 16.85,7.55 v18.2,8.9
  other vias: 14,7.55
BST2  (via drill 0.13 pad 0.15 layers 1-3, 0.25 pad 0.51 layers 1-3)
  Top 0.268: v8,8.9 C16.2
  Route3 0.268: U1.G6 11.44,7.55 11.07,7.91 8.99,7.91 v8,8.9
  other vias: 12,7.55
COMM1  (via drill 0.25 pad 0.51 layers 1-14)
  Top 0.268: v18.4,10 C6.2 | U1.A1 14,4.1 v14.11,4
  Route14 0.268: v14.11,4 14.61,4 15.12,4.53 19.11,4.53 21.41,6.83 21.41,7.27 18.68,10 v18.4,10
COMM2  (via drill 0.25 pad 0.51 layers 1-14)
  Top 0.268: v8.4,10.9 8.45,10.85 C14.2 | U1.A6 12,4.8 v11.8,4.65
  Route14 0.268: v11.8,4.65 11.4,5 11.4,7.9 v8.4,10.9
DEN  (via drill 0.13 pad 0.15 layers 1-3, 0.25 pad 0.51 layers 1-3)
  Top 0.268: v10.9,3.6 R39.1
  Route3 0.268: U1.C5 12.35,6 12.35,6.09 12.14,6.3 11.86,6.3 10.9,5.34 v10.9,3.6
  other vias: 12.4,5.95
EOC  (via drill 0.25 pad 0.51 layers 1-3)
  Top 0.268: J2.4 4.17,12 v5,12 | BATT_CONNECT.9 15,18.5 v14,19.5
  Route3 0.268: v5,12 12.5,19.5 v14,19.5
GND  (via drill 0.13 pad 0.15 layers 1-14, 0.25 pad 0.51, 0.25 pad 0.51 layers 1-14, 0.25 pad 0.51 layers 15-16)
  Top 0.268: U1.J4 12.8,9.42 v13,9.62 13.2,9.42 U1.J3 | U1.J5 12.4,9.46 v12.24,9.62 12,9.38 U1.J6 | U1.J2 13.6,9.46 v13.76,9.62 14,9.38 U1.J1 | v18.2,7.8 C18.2 | C11.2 9.45,4.85 v9.7,4.6 v9.7,5.1 9.95,4.85 C10.2 | R17.2 v9.1,1.7 | v8,7.8 C20.2 | v20.2,3.5 C19.2 | C31.2 2.35,6.61 J2.5 | v15.7,4.1 C22.2 | v17.1,4.1 C21.2 | v18.5,4.1 C33.2 | R22.1 19,9.6 R33.1
  Top 0.406: C23.2 15.6,4.85 C22.2
  Top 0.508: v20.9,11.7 20.3,11.1 R33.1 R29.1 | R29.1 v21.7,11.7 22,12 22,14.76 | v23,11.7 R27.1 R29.1 | R15.2 22,14.76 | 22,14.76 R16.2 | J1.2 5.1,15.78 v5.1,14.4 5.1,13.22 J1.1
  Top 0.95: v20,18 v20,19
  Top 1: v20,19 v20,20 v20,21 v20,21.9 20,22.89 | v20,23 19.65,22.65 | v20,18 19.65,18.35
  Top 1.016: C11.2 C10.2
  Top 1.27: 19.65,22.65 BATT_CONNECT.14 19,21.32 19.29,21.03 19.29,19.97 19,19.68 BATT_CONNECT.13 19.65,18.35
  Bottom 0.268: U3.20 12.03,14.08 12.03,13.73 11.87,13.58 11.49,13.58 11.48,13.59 U3.18 11.1,13.62 v11.1,14.1 | C26.2 5.99,6.11 C24.2 5.22,7.15 RTS.2 | C15.2 3.57,9.47 v3.4,9.3 | U4.2 6.81,10.02 6.81,10.28 6.95,10.42 7.02,10.42 v7.3,10.7 | C17.2 8.9,9.55 v8.9,9.6 | C4.2 23.52,14.56 U2.5 | U2.5 22.66,14.56 U2.4 21.5,14.87 U2.3 20.79,15.18 20.37,14.76 19.66,14.76 19.33,15.09 19.33,15.34 U2.1 18.87,16.49 18.36,16.99 18.36,17.23 C7.2 | U2.5 23.5,13.3 U2.6 24.08,11.8 23.83,11.8 23.19,11.16 23.19,9.61 23.61,9.19 U2.9 v24.8,8.8
  other vias: 11.09,11.52 11.86,11.52 12.62,11.52 13.38,11.52 14.14,11.52 14.9,11.52 12.62,10.25 13.38,10.25 11.48,10.89 14.52,10.89 11.09,10.25 14.9,10.25 13,10.89 12.24,10.89 13.76,10.89 11.86,10.25 14.14,10.25 11.48,9.62 14.52,9.62 12,8.35 12.4,8.35 12.8,8.35 13.2,8.35 13.6,8.35 14,8.35 12,5.95 14,5.95
  pour Top (no thermals): 11.6,8.6 14.4,8.6 15.35,9.79 15.35,11.9 14.9,12.28 11.09,12.28 10.65,11.9 10.65,9.79
  pour Top (no thermals): 15,4.4 15.4,4 18.6,4 18.9,4.3 18.9,5.4 18.8,5.5 15.2,5.5 15,5.3
  pour Route2 (no thermals): 13,26 arc-90 26,13 arc-90 13,0 arc-90 0,13 arc-90
  pour Bottom (no thermals): 13,26 arc90 0,13 arc90 13,0 arc90 26,13 arc90
  pour Route15 (no thermals): 13,26 arc-90 26,13 arc-90 13,0 arc-90 0,13 arc-90
  pour Route14 (no thermals): 13,26 arc90 0,13 arc90 13,0 arc90 26,13 arc90
  pour Route3 (no thermals): 13,26 arc-90 26,13 arc-90 13,0 arc-90 0,13 arc-90
GPS_INT  (via drill 0.25 pad 0.51, 0.25 pad 0.51 layers 1-3)
  Top 0.268: BATT_CONNECT.8 13,22 15.04,19.96 15.6,19.96 15.74,19.82 15.74,19.26 v16,19
  Route3 0.268: v16,19 16.63,18.37 16.63,17.85 19.2,15.28 v19.2,7.5
  Bottom 0.268: v19.2,7.5 19.2,7.04 U2.13
ILIM  (via drill 0.13 pad 0.15 layers 1-14, 0.25 pad 0.51 layers 1-14)
  Top 0.268: v21,7.1 21,8 R38.1 19.9,8.3 R22.2
  Route14 0.268: v21,7.1 19.1,5.2 15.2,5.2 14.8,4.75 13.46,4.75 12.8,5.41 U1.B4
  other vias: 12.8,5.55
IMU_INT  (via drill 0.25 pad 0.51)
  Top 0.268: v16,21 15,22 BATT_CONNECT.10
  Route3 0.268: v8.5,11.9 9.02,12.42 10.26,12.42 10.88,13.04 10.88,13.88 14,17 v14,18.7
  Bottom 0.268: v8.5,11.9 9.36,11.04 U3.12 | v14,18.7 16,20.7 v16,21
LC
  pour Top (no thermals): 20,16 19.2,16.8 10.2,16.8 9.9,16.5 9.9,15.7 11.5,14.1 19.8,14.1 20,14.3
N$6  (via drill 0.13 pad 0.15 layers 1-3, 0.25 pad 0.51 layers 1-3)
  Top 0.268: v10.6,1.7 10.6,2 R17.1
  Route3 0.268: U1.B5 11.7,5.55 11.37,5.22 11.37,3.48 10.6,2.71 v10.6,1.7
  other vias: 12.4,5.55
N$24
  Bottom 0.268: R4.2 17,24.07 D2.C
REGOUT
  Bottom 0.268: C17.1 12.48,10.31 U3.10
RF_IN  (via drill 0.25 pad 0.51)
  Top 0.268: J1.FEED 3.67,14.7
  Top 0.61: 3.67,14.7 v4.4,14.7
  Route14 1.016: v20.3,16.3 15.09,15.44 11.04,14.76 10.53,14.68 10.52,14.68 9.76,14.96 9.54,14.96 9.5,15 v6.6,15.6
  Bottom 0.268: 5.04,15.34 L1.2
  Bottom 0.61: v4.4,14.7 5.04,15.34
  Bottom 0.813: v20.3,16.3 20.3,15.77 U2.2
  Bottom 1.016: L1.2 6.57,15.63 v6.6,15.6
RPPG  (via drill 0.13 pad 0.15 layers 1-3, 0.25 pad 0.51 layers 1-3)
  Top 0.268: R27.2 23,9.3 | 23,9.3 R28.1 | v23.7,9.3 23,9.3
  Route3 0.268: v23.7,9.3 23.7,6.27 22.71,4.85 21.15,3.29 20.02,2.5 14.46,2.5 13.57,3.39 13,3.39 12.29,4.1 12.29,4.47 12.4,4.58 U1.A5
  other vias: 12.4,5.15
RPPO  (via drill 0.13 pad 0.15 layers 1-2, 0.25 pad 0.51 layers 1-2)
  Top 0.268: R29.2 21.7,9.3 | 21.7,9.3 R30.1 | v22.3,9.3 21.7,9.3
  Route2 0.268: U1.C4 12.83,5.98 12.83,6.2 13.63,7 20,7 v22.3,9.3
  other vias: 12.8,5.95
RX
  Bottom 0.268: J3.2 16.12,4.48 R1.2 R9.1
RX0
  Bottom 0.268: R1.1 15.8,6.38 14.85,7.33 14.85,10.06 15.18,10.39 15.42,10.39 U2.17
SCL  (via drill 0.25 pad 0.51, 0.25 pad 0.51 layers 1-3, 0.25 pad 0.51 layers 15-16)
  Top 0.268: v5.9,3.6 R13.1 | U1.A3 13.2,4.56 13.24,4.52 13.24,4.46 v13.4,4.3 | v12,19.7 11,18.7 BATT_CONNECT.5
  Route3 0.268: v5.9,3.6 4.87,4.63 3.93,4.63 3.21,5.35 3.21,7.99 3.19,8.02 3.19,8.4 2.45,9.14 1.81,9.14 1.31,9.65 1.31,10.37 2,11.06 J2.3 | v12,19.7 10.12,19.7 6.19,15.77 6.19,14.9 5.27,13.99 4.59,13.99 v3.4,12.8
  Route15 0.268: v5.9,3.6 10.31,3.6 10.73,3.19 11.07,3.19 11.38,3.5 12.6,3.5 v13.4,4.3 13.81,4.3 13.93,4.41 20.31,4.41 v21.2,5.3
  Bottom 0.268: R6.1 20.4,5.3 U2.11 21.25,5.35 v21.2,5.3 | J2.3 2.88,12 Q2.3 3.19,12.59 v3.4,12.8
SCL/SCLK
  Bottom 0.268: Q2.2 4.56,10.97 R8.1 7.49,12.03 7.49,12.68 9.5,14.69 13.07,14.69 13.28,14.48 U3.23
SDA  (via drill 0.13 pad 0.15 layers 1-14, 0.25 pad 0.51, 0.25 pad 0.51 layers 1-3, 0.25 pad 0.51 layers 15-16)
  Top 0.268: v5.9,4.7 R14.1 | v10,22.7 10.95,22.7 BATT_CONNECT.6
  Route3 0.268: v5.9,4.7 5.9,9.92 3.82,12 3.3,12 1.83,13.47 J2.2 7.21,19.38 7.21,20.83 9.09,22.7 v10,22.7
  Route14 0.268: U1.B3 13.17,5.58 13.17,5.7 12.95,5.92 12.65,5.92 12.21,5.49 12.21,4.48 11.8,4.07 v11.8,4
  Route15 0.268: v5.9,4.7 8.91,4.7 9.63,3.99 11.79,3.99 v11.8,4 14.5,6.7 23.5,6.7 v24.2,7.4
  Bottom 0.268: Q1.3 2.69,13.99 J2.2 | v24.2,7.4 23.97,7.63 U2.10 23.3,6.64 21.42,4.76 21.06,4.76 R5.1
  other vias: 13.2,5.55
SDA/SDI
  Bottom 0.268: Q1.2 4.46,13.11 R7.1 6.55,13.03 7.32,13.03 9.35,15.06 11,15.06 13.22,15.06 13.65,14.63 13.65,14.16 U3.24
SINK  (via drill 0.13 pad 0.15 layers 1-3, 0.25 pad 0.51 layers 1-3)
  Top 0.268: v15,3.9 16,2.9 R2.1
  Route3 0.268: U1.C2 13.65,6 13.65,6.09 13.86,6.3 14.14,6.3 15,5.45 v15,3.9
  other vias: 13.6,5.95
TS/EOC  (via drill 0.13 pad 0.15 layers 1-3, 0.25 pad 0.51 layers 1-3)
  Top 0.268: R19.1 6.7,2.7 v6.1,2.7 5.9,2.7 4.3,4.3 RTS.1 | RTS.1 3.3,6.53 C31.1 | RTS.1 4.77,6 v6.4,6 | BATT_CONNECT.4 9.4,22.25 9.74,21.91 9.74,16.88 9.4,16.54 v9.4,14.7
  Route3 0.268: U1.H4 12.37,7.52 12.37,7.4 11.87,6.9 9,6.9 6.9,4.8 6.9,3.5 v6.1,2.7 | v6.4,6 7.39,6.99 7.39,11.57 8.7,12.88 8.7,14 v9.4,14.7
  other vias: 12.8,7.95
TX
  Bottom 0.268: J3.1 R10.1 R3.2 | J3.1
TX0
  Bottom 0.268: R3.1 15.57,7.12 U2.16
VBACKUP  (via drill 0.25 pad 0.51)
  Route3 0.268: v24.8,9.7 24.8,17.57 24.78,17.62 23.91,18.49 23.91,19.07 23.1,19.89 22.51,19.89 21,21.4 v21,22.5
  Bottom 0.268: v24.8,9.7 24.17,9.7 U2.8 | v21,22.5 20.94,22.44 19.78,22.44 19.49,22.15 C13.1 17.92,22.15 R4.1
VCC
  Bottom 0.268: U2.7 24.7,11.57 24.95,11.57 25.3,11.92 25.3,15.74 24.8,16.24 24.09,16.24 23.65,15.8 C4.1 22.66,16.3 21.6,16.3 20.46,17.44 C7.1 18.52,17.99 18.52,18.23 18.19,18.56 17.49,18.56 17.06,18.13 FB1.2
VDD5V
  Top 0.268: U1.F1 15.4,7.15 C18.1
VDD18  (via drill 0.25 pad 0.51, 0.25 pad 0.51 layers 1-3)
  Top 0.268: 21,6.5 21,4.38 C19.1 20.8,4 v21.2,4 | 21,6.5 R34.2 R38.2 | 21,6.5 R23.2 | R30.2 R23.2 | R23.2 22.5,6.5 23,7 R28.2 | U1.F6 11.15,7.15 v10.9,7.4 10.45,7.4 C20.1 | R39.2 R13.2 | R19.2 7.9,3.4 R13.2 | R13.2 R14.2 6.9,5.5 v6.8,5.5
  Route3 0.268: v6.8,5.5 8.7,7.4 v10.9,7.4
  Route14 0.268: v10.9,7.4 10.9,4.3 11.81,3.39 13.57,3.39 13.96,3 20.4,3 21.2,3.8 v21.2,4
VOSET  (via drill 0.25 pad 0.51 layers 1-3)
  Top 0.268: U1.A4 12.8,4.4 v12.7,4.3 | v20.3,4.7 R34.1 | v21,9.3 20.4,9.9 R33.2
  Route3 0.268: v21,9.3 21,7.68 20.59,7.27 20.59,4.99 v20.3,4.7 19.57,3.97 19.57,3.35 19.15,2.9 14.58,2.9 13.73,3.76 13.24,3.76 v12.7,4.3
VOUT  (via drill 0.13 pad 0.15 layers 1-3, 0.25 pad 0.51 layers 1-3)
  Top 0.268: U1.D6 U1.D5 U1.D4 U1.D3 U1.D2 U1.D1 | v7.8,11.4 7.4,11.8 6.8,11.8
  Top 1.27: C11.1 7.55,6.35 6.8,7.1 6.8,11.8 7.9,12.9 7.9,16.2 7,17.1 BATT_CONNECT.1 6.79,18.35 6.14,19 6.14,21.14 7,22 BATT_CONNECT.2
  Route3 0.268: U1.G3 U1.H3 13.25,8 14.14,8 14.35,8.21 14.35,8.49 13.64,9.2 11.3,9.2 9.11,11.4 v7.8,11.4
  other vias: 13.2,7.95 13.2,7.55
  pour Top (no thermals): 8.5,6.7 8.7,6.9 11.5,6.9 11.9,6.5 12.1,6.5 12.1,6.2 11.9,6.2 11.5,5.8 8.7,5.8 8.5,6
VRECT
  Top 0.268: U1.E6 U1.E5 | U1.E1 U1.E2 | U1.E5 U1.F5 U1.F4 | U1.E2 U1.F2 U1.F3 | U1.F3 U1.F4 | U1.E5 12.8,6.75 | 12.8,6.75 13.2,6.75 | 13.2,6.75 U1.E2 | U1.F4 12.8,6.75 | U1.F3 13.2,6.75
  pour Top (no thermals): 13.9,6.9 19.5,6.9 19.7,6.7 19.7,2.6 19,1.9 17.3,1.9 17,2.2 17,3.5 17.3,3.8 18.7,3.8 19.1,4.2 19.1,5.5 18.9,5.7 15.4,5.7 15.2,5.9 14.6,5.9 14.3,6.2 14.3,6.5 14.2,6.6 13.9,6.6

### Text on the board
tPlace: Maka-Niu C/Sv1.1 | KELLER
bPlace: Maka-Niu / Charging/ / Sensing v1.1 / Open Oceans / 2021 | ACC/ / GYR | +Y | +X | +Z | +X | +Z | +Y | MAG
bNames: TX | RX